# Altium schematic sheet FMC_Metlino_Fabric-Timing.SchDoc: FMC_Metlino_Fabric-Timing
size 420 x 297 mm; Projet: FMC_Metlino_Fabric-Timing; Date: 2021; Author: Filip Świtakowski; CompanyName: WUT; DrawnBy: Filip Świtakowski; Organization: WUT; Revision: 1.0; SheetNumber: -; SheetTotal: -; ModifiedBy: -; CreateDate: XX/XX/XXXX; CheckedDate: -; Designer: Filip Świtakowski; ModifiedDate: -; ProjectName: FMC LVDS 32
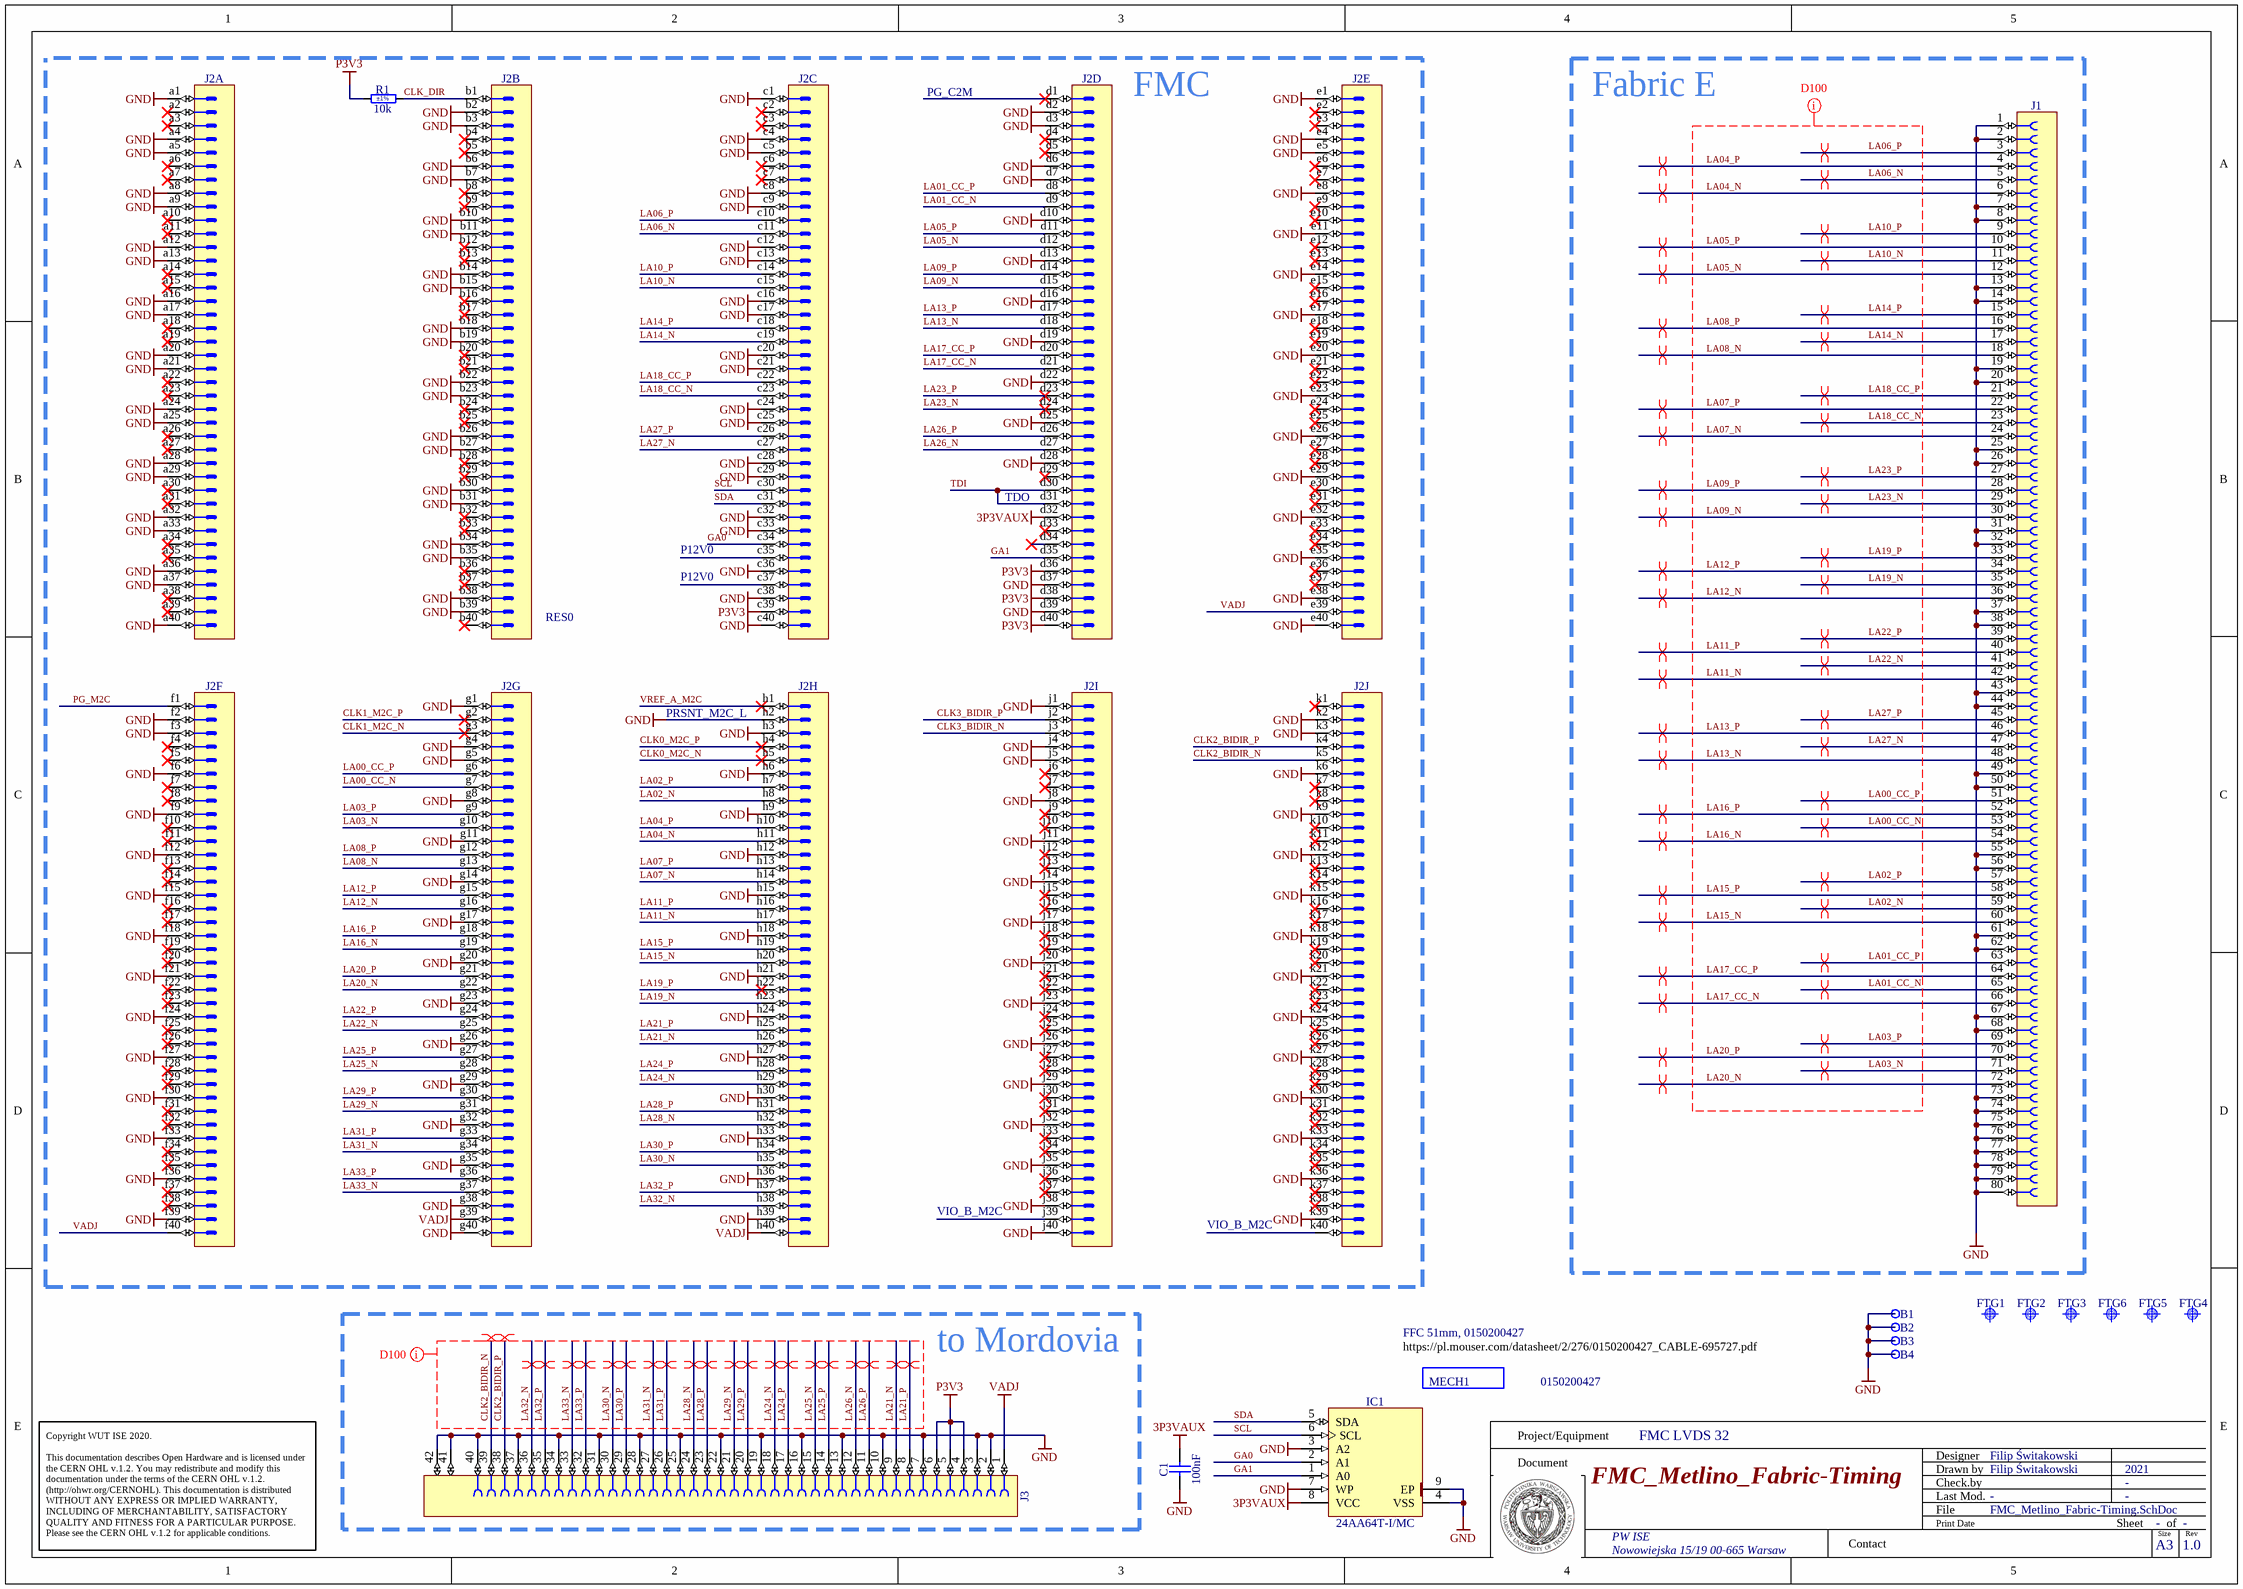
[diagram p0: FMC_Metlino_Fabric-Timing.SchDoc]

## Parts
B1  Plated Hole  [MTG300_600]  (value not drawn)  (no BOM)
B2  Plated Hole  [MTG300_600]  (value not drawn)  (no BOM)
B3  Plated Hole  [MTG300_600]  (value not drawn)  (no BOM)
B4  Plated Hole  [MTG300_600]  (value not drawn)  (no BOM)
C1  100nF  [CAPC1005X55N]
FTG1  Use only in PCB  [FIDUCIAL_TOP_S100-200]  (value not drawn)  (no BOM)
FTG2  Use only in PCB  [FIDUCIAL_TOP_S100-200]  (value not drawn)  (no BOM)
FTG3  Use only in PCB  [FIDUCIAL_TOP_S100-200]  (value not drawn)  (no BOM)
FTG4  Use only in PCB  [FIDUCIAL_TOP_S100-200]  (value not drawn)  (no BOM)
FTG5  Use only in PCB  [FIDUCIAL_TOP_S100-200]  (value not drawn)  (no BOM)
FTG6  Use only in PCB  [FIDUCIAL_TOP_S100-200]  (value not drawn)  (no BOM)
IC1  24AA64T-I/MC  [SON50P300X200X100-9N-R175X155]
J1  Socket 80  [SAMTEC_FSI-140-10-X-D-AD]  (value not drawn)
J2  VITA 57  [SAMTEC_ASP-134488-01]  (value not drawn)  (parts A,B,C,D,E,F,G,H,I,J of 10)
J3  FFC/FPC  [MOLEX_505110-4091]  (value not drawn)
MECH1  0150200427  (mechanical)
R1  10k  Tolerance: ±1%  [RESC1608X55N]

## Blocks framed on the sheet
FMC: J2 R1
Fabric E: J1
to Mordovia: J3

## Nets
3P3VAUX: C1.2 IC1.8(VCC) J2.d32
GND: B1.1 B2.1 B3.1 B4.1 C1.1 IC1.3(A2) IC1.4(VSS) IC1.7(WP) IC1.9(EP) J1.1 J1.2 J1.7 J1.8 J1.13 J1.14 J1.19 J1.20 J1.25 J1.26 J1.31 J1.32 J1.37 J1.38 J1.43 J1.44 J1.49 J1.50 J1.55 J1.56 J1.61 J1.62 J1.67 J1.68 J1.73 J1.74 J1.75 J1.76 J1.77 J1.78 J1.79 J1.80 J2.a1 J2.a4 J2.a5 J2.a8 J2.a9 J2.a12 J2.a13 J2.a16 J2.a17 J2.a20 J2.a21 J2.a24 J2.a25 J2.a28 J2.a29 J2.a32 J2.a33 J2.a36 J2.a37 J2.a40 J2.b2 J2.b3 J2.b6 J2.b7 J2.b10 J2.b11 J2.b14 J2.b15 J2.b18 J2.b19 J2.b22 J2.b23 J2.b26 J2.b27 J2.b30 J2.b31 J2.b34 J2.b35 J2.b38 J2.b39 J2.c1 J2.c4 J2.c5 J2.c8 J2.c9 J2.c12 J2.c13 J2.c16 J2.c17 J2.c20 J2.c21 J2.c24 J2.c25 J2.c28 J2.c29 J2.c32 J2.c33 J2.c36 J2.c38 J2.c40 J2.d2 J2.d3 J2.d6 J2.d7 J2.d10 J2.d13 J2.d16 J2.d19 J2.d22 J2.d25 J2.d28 J2.d37 J2.d39 J2.e1 J2.e4 J2.e5 J2.e8 J2.e11 J2.e14 J2.e17 J2.e20 J2.e23 J2.e26 J2.e29 J2.e32 J2.e35 J2.e38 J2.e40 J2.f2 J2.f3 J2.f6 J2.f9 J2.f12 J2.f15 J2.f18 J2.f21 J2.f24 J2.f27 J2.f30 J2.f33 J2.f36 J2.f39 J2.g1 J2.g4 J2.g5 J2.g8 J2.g11 J2.g14 J2.g17 J2.g20 J2.g23 J2.g26 J2.g29 J2.g32 J2.g35 J2.g38 J2.g40 J2.h2 J2.h3 J2.h6 J2.h9 J2.h12 J2.h15 J2.h18 J2.h21 J2.h24 J2.h27 J2.h30 J2.h33 J2.h36 J2.h39 J2.j1 J2.j4 J2.j5 J2.j8 J2.j11 J2.j14 J2.j17 J2.j20 J2.j23 J2.j26 J2.j29 J2.j32 J2.j35 J2.j38 J2.j40 J2.k2 J2.k3 J2.k6 J2.k9 J2.k12 J2.k15 J2.k18 J2.k21 J2.k24 J2.k27 J2.k30 J2.k33 J2.k36 J2.k39 J3.2 J3.3 J3.7 J3.10 J3.13 J3.16 J3.19 J3.22 J3.25 J3.28 J3.31 J3.34 J3.37 J3.40 J3.41 J3.42
P3V3: J2.c39 J2.d36 J2.d38 J2.d40 J3.4 J3.5 J3.6 R1.1
VADJ: J2.e39 J2.f40 J2.g39 J2.h40 J3.1
CLK0_M2C_N: J2.h5
CLK0_M2C_P: J2.h4
CLK1_M2C_N: J2.g3
CLK1_M2C_P: J2.g2
CLK2_BIDIR_N: J2.k5 J3.39
CLK2_BIDIR_P: J2.k4 J3.38
CLK3_BIDIR_N: J2.j3
CLK3_BIDIR_P: J2.j2
CLK_DIR: J2.b1 R1.2
GA0: IC1.2(A1) J2.c34
GA1: IC1.1(A0) J2.d35
LA00_CC_N: J1.53 J2.g7
LA00_CC_P: J1.51 J2.g6
LA01_CC_N: J1.65 J2.d9
LA01_CC_P: J1.63 J2.d8
LA02_N: J1.59 J2.h8
LA02_P: J1.57 J2.h7
LA03_N: J1.71 J2.g10
LA03_P: J1.69 J2.g9
LA04_N: J1.6 J2.h11
LA04_P: J1.4 J2.h10
LA05_N: J1.12 J2.d12
LA05_P: J1.10 J2.d11
LA06_N: J1.5 J2.c11
LA06_P: J1.3 J2.c10
LA07_N: J1.24 J2.h14
LA07_P: J1.22 J2.h13
LA08_N: J1.18 J2.g13
LA08_P: J1.16 J2.g12
LA09_N: J1.30 J2.d15
LA09_P: J1.28 J2.d14
LA10_N: J1.11 J2.c15
LA10_P: J1.9 J2.c14
LA11_N: J1.42 J2.h17
LA11_P: J1.40 J2.h16
LA12_N: J1.36 J2.g16
LA12_P: J1.34 J2.g15
LA13_N: J1.48 J2.d18
LA13_P: J1.46 J2.d17
LA14_N: J1.17 J2.c19
LA14_P: J1.15 J2.c18
LA15_N: J1.60 J2.h20
LA15_P: J1.58 J2.h19
LA16_N: J1.54 J2.g19
LA16_P: J1.52 J2.g18
LA17_CC_N: J1.66 J2.d21
LA17_CC_P: J1.64 J2.d20
LA18_CC_N: J1.23 J2.c23
LA18_CC_P: J1.21 J2.c22
LA19_N: J1.35 J2.h23
LA19_P: J1.33 J2.h22
LA20_N: J1.72 J2.g22
LA20_P: J1.70 J2.g21
LA21_N: J2.h26 J3.9
LA21_P: J2.h25 J3.8
LA22_N: J1.41 J2.g25
LA22_P: J1.39 J2.g24
LA23_N: J1.29 J2.d24
LA23_P: J1.27 J2.d23
LA24_N: J2.h29 J3.18
LA24_P: J2.h28 J3.17
LA25_N: J2.g28 J3.15
LA25_P: J2.g27 J3.14
LA26_N: J2.d27 J3.12
LA26_P: J2.d26 J3.11
LA27_N: J1.47 J2.c27
LA27_P: J1.45 J2.c26
LA28_N: J2.h32 J3.24
LA28_P: J2.h31 J3.23
LA29_N: J2.g31 J3.21
LA29_P: J2.g30 J3.20
LA30_N: J2.h35 J3.30
LA30_P: J2.h34 J3.29
LA31_N: J2.g34 J3.27
LA31_P: J2.g33 J3.26
LA32_N: J2.h38 J3.36
LA32_P: J2.h37 J3.35
LA33_N: J2.g37 J3.33
LA33_P: J2.g36 J3.32
PG_M2C: J2.f1
SCL: IC1.6(SCL) J2.c30
SDA: IC1.5(SDA) J2.c31
TDI: J2.d30 J2.d31
VREF_A_M2C: J2.h1

Not connected (* = marked no-connect by the designer): J2 a2* a3* a6* a7* a10* a11* a14* a15* a18* a19* a22* a23* a26* a27* a30* a31* a34* a35* a38* a39* b4* b5* b8* b9* b12* b13* b16* b17* b20* b21* b24* b25* b28* b29* b32* b33* b36* b37* b40* c2* c3* c6* c7* c35 c37 d1* d4* d5* d29* d33* d34* e2* e3* e6* e7* e9* e10* e12* e13* e15* e16* e18* e19* e21* e22* e24* e25* e27* e28* e30* e31* e33* e34* e36* e37* f4* f5* f7* f8* f10* f11* f13* f14* f16* f17* f19* f20* f22* f23* f25* f26* f28* f29* f31* f32* f34* f35* f37* f38* j6* j7* j9* j10* j12* j13* j15* j16* j18* j19* j21* j22* j24* j25* j27* j28* j30* j31* j33* j34* j36* j37* j39 k1* k7* k8* k10* k11* k13* k14* k16* k17* k19* k20* k22* k23* k25* k26* k28* k29* k31* k32* k34* k35* k37* k38* k40

## Layout directives
differential pair: CLK2_BIDIR_N, CLK2_BIDIR_P, LA00_CC_N, LA00_CC_P, LA01_CC_N, LA01_CC_P, LA02_N, LA02_P, LA03_N, LA03_P, LA04_N, LA04_P, LA05_N, LA05_P, LA06_N, LA06_P, LA07_N, LA07_P, LA08_N, LA08_P, LA09_N, LA09_P, LA10_N, LA10_P, LA11_N, LA11_P, LA12_N, LA12_P, LA13_N, LA13_P, LA14_N, LA14_P, LA15_N, LA15_P, LA16_N, LA16_P, LA17_CC_N, LA17_CC_P, LA18_CC_N, LA18_CC_P, LA19_N, LA19_P, LA20_N, LA20_P, LA21_N, LA21_P, LA22_N, LA22_P, LA23_N, LA23_P, LA24_N, LA24_P, LA25_N, LA25_P, LA26_N, LA26_P, LA27_N, LA27_P, LA28_N, LA28_P, LA29_N, LA29_P, LA30_N, LA30_P, LA31_N, LA31_P, LA32_N, LA32_P, LA33_N, LA33_P
net class D100: CLK2_BIDIR_N, CLK2_BIDIR_P, LA00_CC_N, LA00_CC_P, LA01_CC_N, LA01_CC_P, LA02_N, LA02_P, LA03_N, LA03_P, LA04_N, LA04_P, LA05_N, LA05_P, LA06_N, LA06_P, LA07_N, LA07_P, LA08_N, LA08_P, LA09_N, LA09_P, LA10_N, LA10_P, LA11_N, LA11_P, LA12_N, LA12_P, LA13_N, LA13_P, LA14_N, LA14_P, LA15_N, LA15_P, LA16_N, LA16_P, LA17_CC_N, LA17_CC_P, LA18_CC_N, LA18_CC_P, LA19_N, LA19_P, LA20_N, LA20_P, LA21_N, LA21_P, LA22_N, LA22_P, LA23_N, LA23_P, LA24_N, LA24_P, LA25_N, LA25_P, LA26_N, LA26_P, LA27_N, LA27_P, LA28_N, LA28_P, LA29_N, LA29_P, LA30_N, LA30_P, LA31_N, LA31_P, LA32_N, LA32_P, LA33_N, LA33_P

## Notes on the sheet
- PG_C2M
- (near J2) TDO
- P12V0
- RES0
- (near J2) PRSNT_M2C_L
- VIO_B_M2C
- (near MECH1) FFC 51mm, 0150200427
- (near MECH1) https://pl.mouser.com/datasheet/2/276/0150200427_CABLE-695727.pdf
- Project/Equipment
- Document
- Designer
- Drawn by
- Check.by
- Copyright WUT ISE 2020.
  This documentation describes Open Hardware and is licensed under the CERN OHL v.1.2. You may redistribute and modify this documentation under the terms of the CERN OHL v.1.2. (http://ohwr.org/CERNOHL). This documentation is distributed WITHOUT ANY EXPRESS OR IMPLIED WARRANTY, INCLUDING OF MERCHANTABILITY, SATISFACTORY QUALITY AND FITNESS FOR A PARTICULAR PURPOSE. Please see the CERN OHL v.1.2 for applicable conditions.
- PW ISE
- Contact
- File
- Last Mod.
- Print Date
- Sheet
- Size
- A3
- of
- Rev
- Nowowiejska 15/19 00-665 Warsaw

## Library data of the parts
B1-B4 = PLATED_HOLE3.0_PAD6.0: Single Terminal Socket; Part Description: Plated Through Hole: Hole Dia.=3.0mm Pad Dia.=6.0mm; Mounted: No; Table: Pads; Part Number: PLATED_HOLE3.0_PAD6.0; Component Type: Standard (No BOM); Designator: Single Terminal Socket; Library Reference: Single Terminal Socket; Pin Count: 1; Family: Plated Hole; Socket: No; SMD: No; Status: None; ComponentHeight: 0mm; Author: CERN DEM JLC; CreateDate: 26.05.2008; LatestRevisionDate: 26.05.2008; PackageDescription: Plated Through Hole: Hole Dia.=3.0mm Pad Dia.=6.0mm
C1 = CC0402_100NF_50V_10%_X7R: Non-polarised capacitor; Part Description: SMD Multilayer Chip Ceramic Capacitor; Manufacturer: GENERIC; Manufacturer1 Part Number: GRM155R71H104KE14D; Voltage: 50V; TC: X7R; Tolerance: ±10%; Part Number: CC0402_100NF_50V_10%_X7R; Component Kind: Standard; Component Type: Standard; Pin Count: 2; Value: 100nF; Status: None; Manufacturer Part Number: CC0402_100NF_50V_10%_X7R; Case: 0402; Mounted: Yes; Socket: No; SMD: Yes; Sense: No; Manufacturer1 Example: MURATA; Manufacturer1 ComponentHeight: 0.55mm; HelpURL: \\cern.ch\dfs\Applications\Altium\Datasheets\CC0402_MURATA_GRM155R71H104KE14D.pdf; Author: CERN DEM MR; CreateDate: 30.06.2017; LatestRevisionDate: 30.06.2017
FTG1-FTG6 = FIDUCIAL_TARGET_S100-200: Fiducial Target; Part Description: Scare Fiducial Target, Top Layer, 1.0mm, Top Sloder 2.0mm, Keepout =2.0mm; Mounted: No; Table: Pads; Part Number: FIDUCIAL_TARGET_S100-200; Component Type: Standard (No BOM); Pin Count: 1; Family: Fiducial; Socket: No; SMD: Yes; Status: None; ComponentHeight: 0mm; Author: CERN DEM JLC; CreateDate: 09.02.2010; LatestRevisionDate: 09.02.2010; PackageDescription: Scare Fiducial Target, Top Layer, 1.0mm, Top Sloder 2.0mm, Keepout =2.0mm
IC1 = 24AA64T-I/MC: 1.7V-5.5V 64K I2C Serial EEPROM; Part Description: 1.7V-5.5V, 64K  (8K x 8-bit) I2C Serial EEPROM; Manufacturer: MICROCHIP TECHNOLOGY; PressFit: No; Bonding: No; Part Number: 24AA64T-I/MC; Component Kind: Standard; Component Type: Standard; Device: 24AA64T-I/MC; PackageDescription: SON (DFN), 0.50mm pitch, 8 pin, 2mm X 3mm X 1.00mm H body (w/thermal tab 1.75 X 1.55mm),  IPC Medium Density; Manufacturer Part Number: 24AA64T-I/MC; Pin Count: 9; Case: DFN8; Mounted: Yes; Socket: No; SMD: Yes; Sense: No; ComponentHeight: 1mm; HelpURL: \\cern.ch\dfs\Applications\Altium\Datasheets\24AA64T-I-MC.pdf; Author: CERN DEM JLC; CreateDate: 18.11.2009; LatestRevisionDate: 24.01.2011
J1 = SAMTEC_FSI-140-10-L-D-AD: Connector 80 Female; Part Description: 80 Contacts, Pitch 1mm, Dual Row Low Profile (10mm) & Elevated One-Piece With Alignment Pins; Manufacturer: SAMTEC; PressFit: No; Part Number: SAMTEC_FSI-140-10-L-D-AD; Component Kind: Standard; Component Type: Standard; Pin Count: 80; Family: Socket 80; Mounted: Yes; Socket: No; SMD: Yes; Sense: No; Status: None; Manufacturer Part Number: FSI-140-10-L-D-AD; ComponentHeight: 10mm; HelpURL: \\cern.ch\dfs\Applications\Altium\Datasheets\SAMTEC_FSI-140-10-L-D-AD.pdf; Author: CERN DEM BC; CreateDate: 08.06.2021; LatestRevisionDate: 08.06.2021
J2 = SAMTEC_ASP-134488-01: Connector VITA 57, 400 Male contacts in 10 row abcdefghj; Part Description: 400 contacts (10 rows abcdefghj) Surface Mount Male Connector, VITA 57 (MC-HPC-10); Manufacturer: SAMTEC; Part Number: SAMTEC_ASP-134488-01; Component Kind: Standard; Component Type: Standard; Pin Count: 400; Family: VITA 57; Mounted: Yes; Socket: No; SMD: Yes; Status: None; Manufacturer Part Number: ASP-134488-01; ComponentHeight: 6.1mm; HelpURL: \\cern.ch\dfs\Applications\Altium\Datasheets\SAMTEC_ASP-134488-01.pdf; Author: CERN DEM JLC; CreateDate: 30/04/2009; LatestRevisionDate: 17/08/2009; Table: SAMTEC
J3 = MOLEX_505110-4091: Connector 40 Female +2; Part Description: Easy-On FFC/FPC Connector 0.50mm Pitch, FD19 Series, Right-Angle, Bottom Contact, 40 Circuits; Manufacturer: MOLEX; PressFit: No; Part Number: MOLEX_505110-4091; Component Kind: Standard; Component Type: Standard; Pin Count: 42; Family: FFC/FPC; Mounted: Yes; Socket: No; SMD: Yes; Sense: No; Status: None; Manufacturer Part Number: 505110-4091; ComponentHeight: 1.92mm; HelpURL: \\cern.ch\dfs\Applications\Altium\Datasheets\MOLEX_505110-4091.pdf; Author: CERN DEM JMW; CreateDate: 22.01.2019; LatestRevisionDate: 22.01.2019
MECH1 = Generic_mechanical: 51mm FFC 0.5mm; Part Description: FFC 40pos 0.5mm; Manufacturer: Molex; PressFit: No; Part Number: 0150200427; Component Type: Standard; Footprint: generic_MECH; Pin Count: 0; PackageDescription: generic; Mounted: Yes; Socket: No; SMD: No; Sense: No; Status: None; Value: 51mm; Manufacturer Part Number: 0150200427; ComponentHeight: generic; Author: GK; CreateDate: 28.10.2019; LatestRevisionDate: 28.10.2019
R1 = R0603_10K_1%_0.1W_100PPM: Resistor - 1%; Part Description: General Purpose Thick Film Chip Resistor; Manufacturer: GENERIC; Manufacturer1 Part Number: NRC06F1002TRF; Power: 0.1W; TC: ±100ppm/°C; PressFit: No; Part Number: R0603_10K_1%_0.1W_100PPM; Component Kind: Standard; Component Type: Standard; Pin Count: 2; Value: 10k; Status: Preferred; Manufacturer Part Number: R0603_10K_1%_0.1W_100PPM; Case: 0603; Mounted: Yes; Sense: No; Socket: No; SMD: Yes; Manufacturer1 Example: NIC COMPONENT; Manufacturer1 ComponentHeight: 0.55mm; HelpURL: \\cern.ch\dfs\Applications\Altium\Datasheets\R0603_NIC_NRC.pdf; Author: CERN DEM JLC; CreateDate: 03.12.2007; LatestRevisionDate: 13.03.2008